# Altium project Switch.PrjPcb
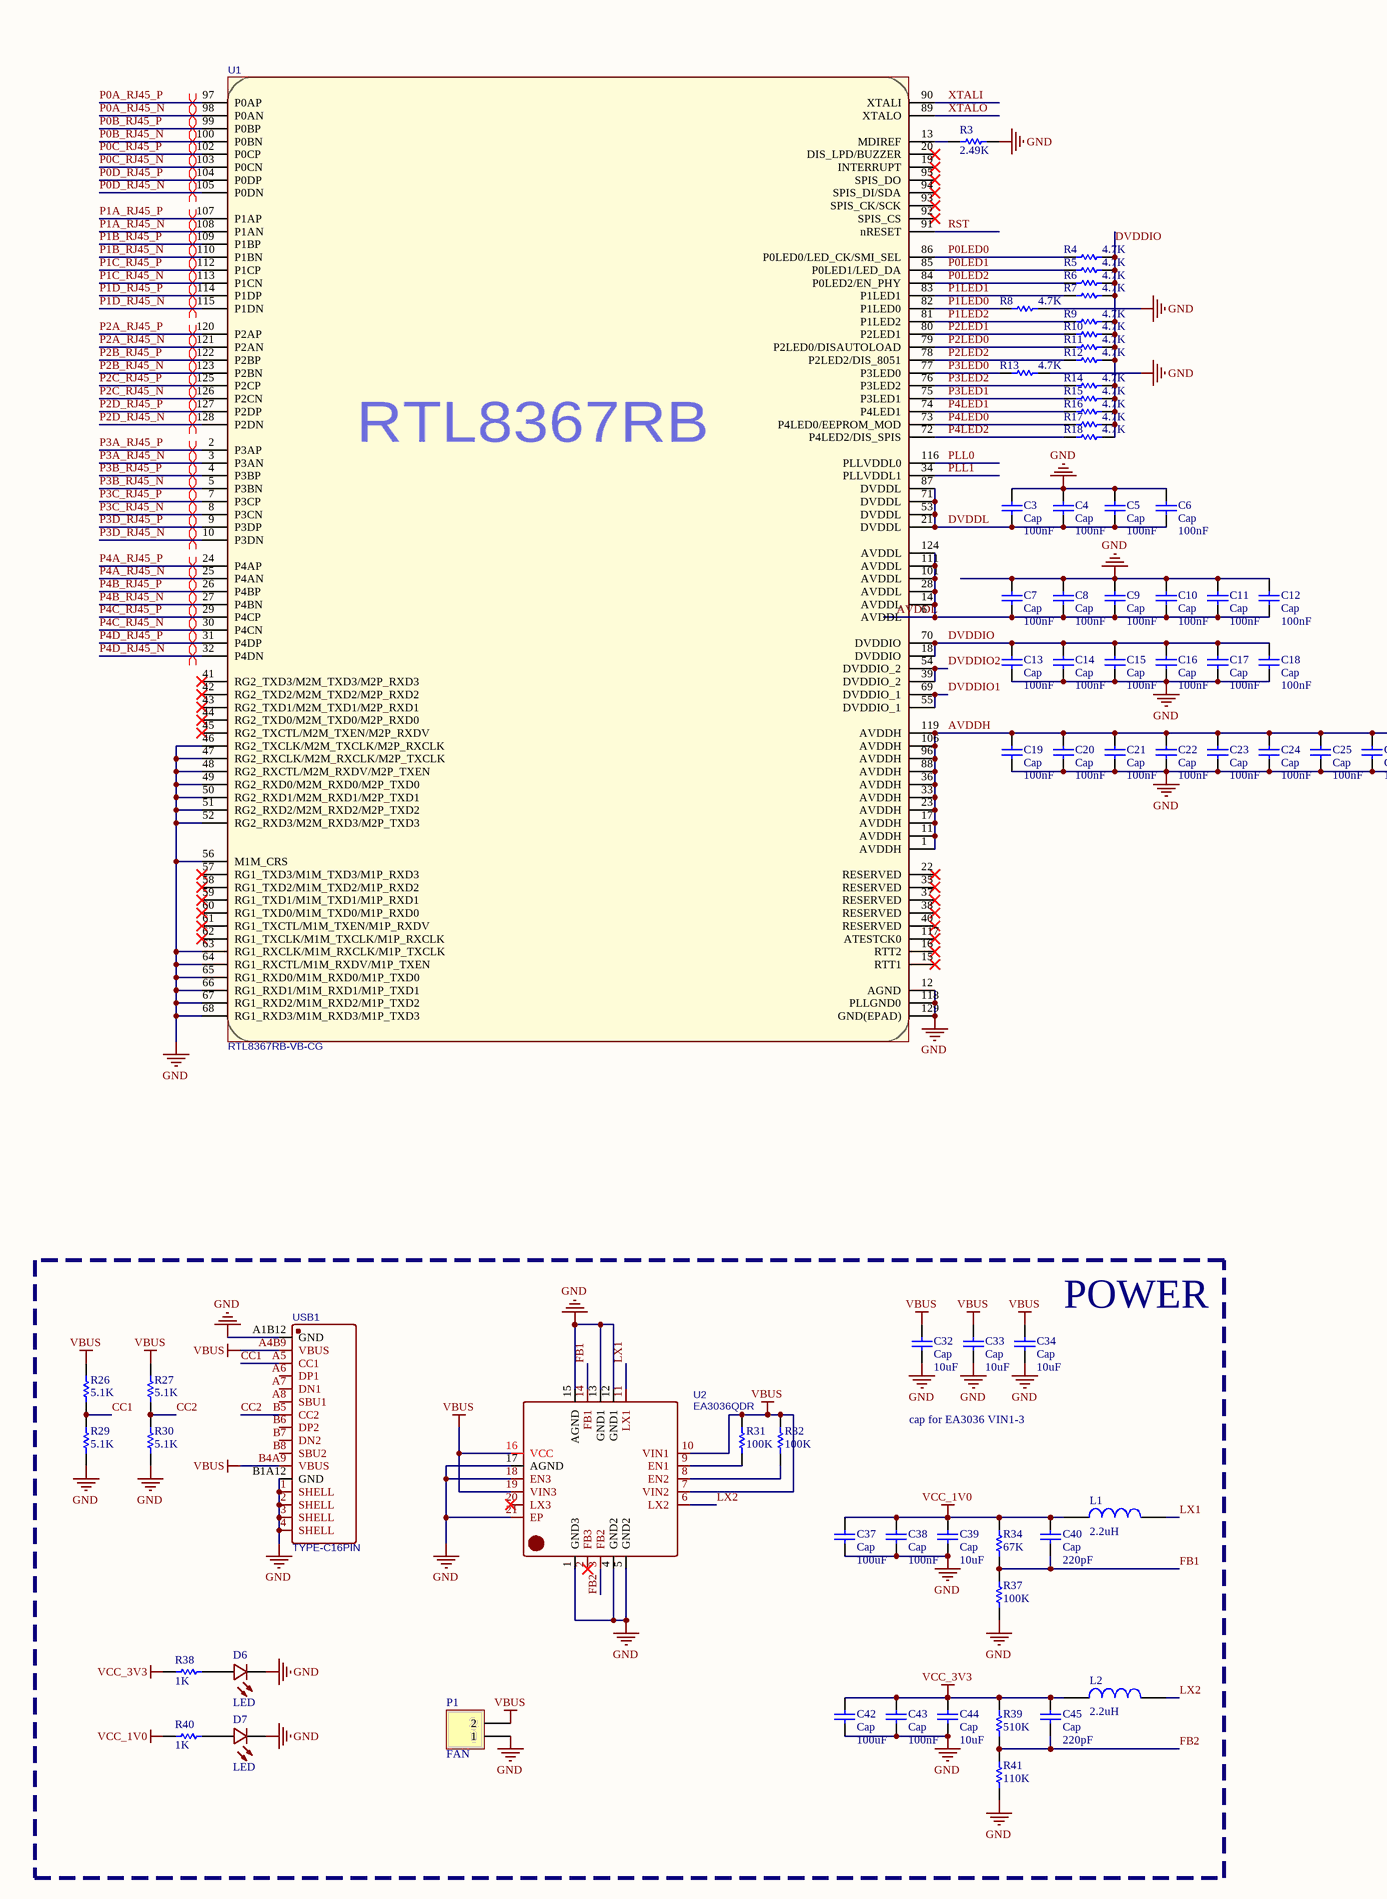
[diagram p0: switch.SchDoc, left]
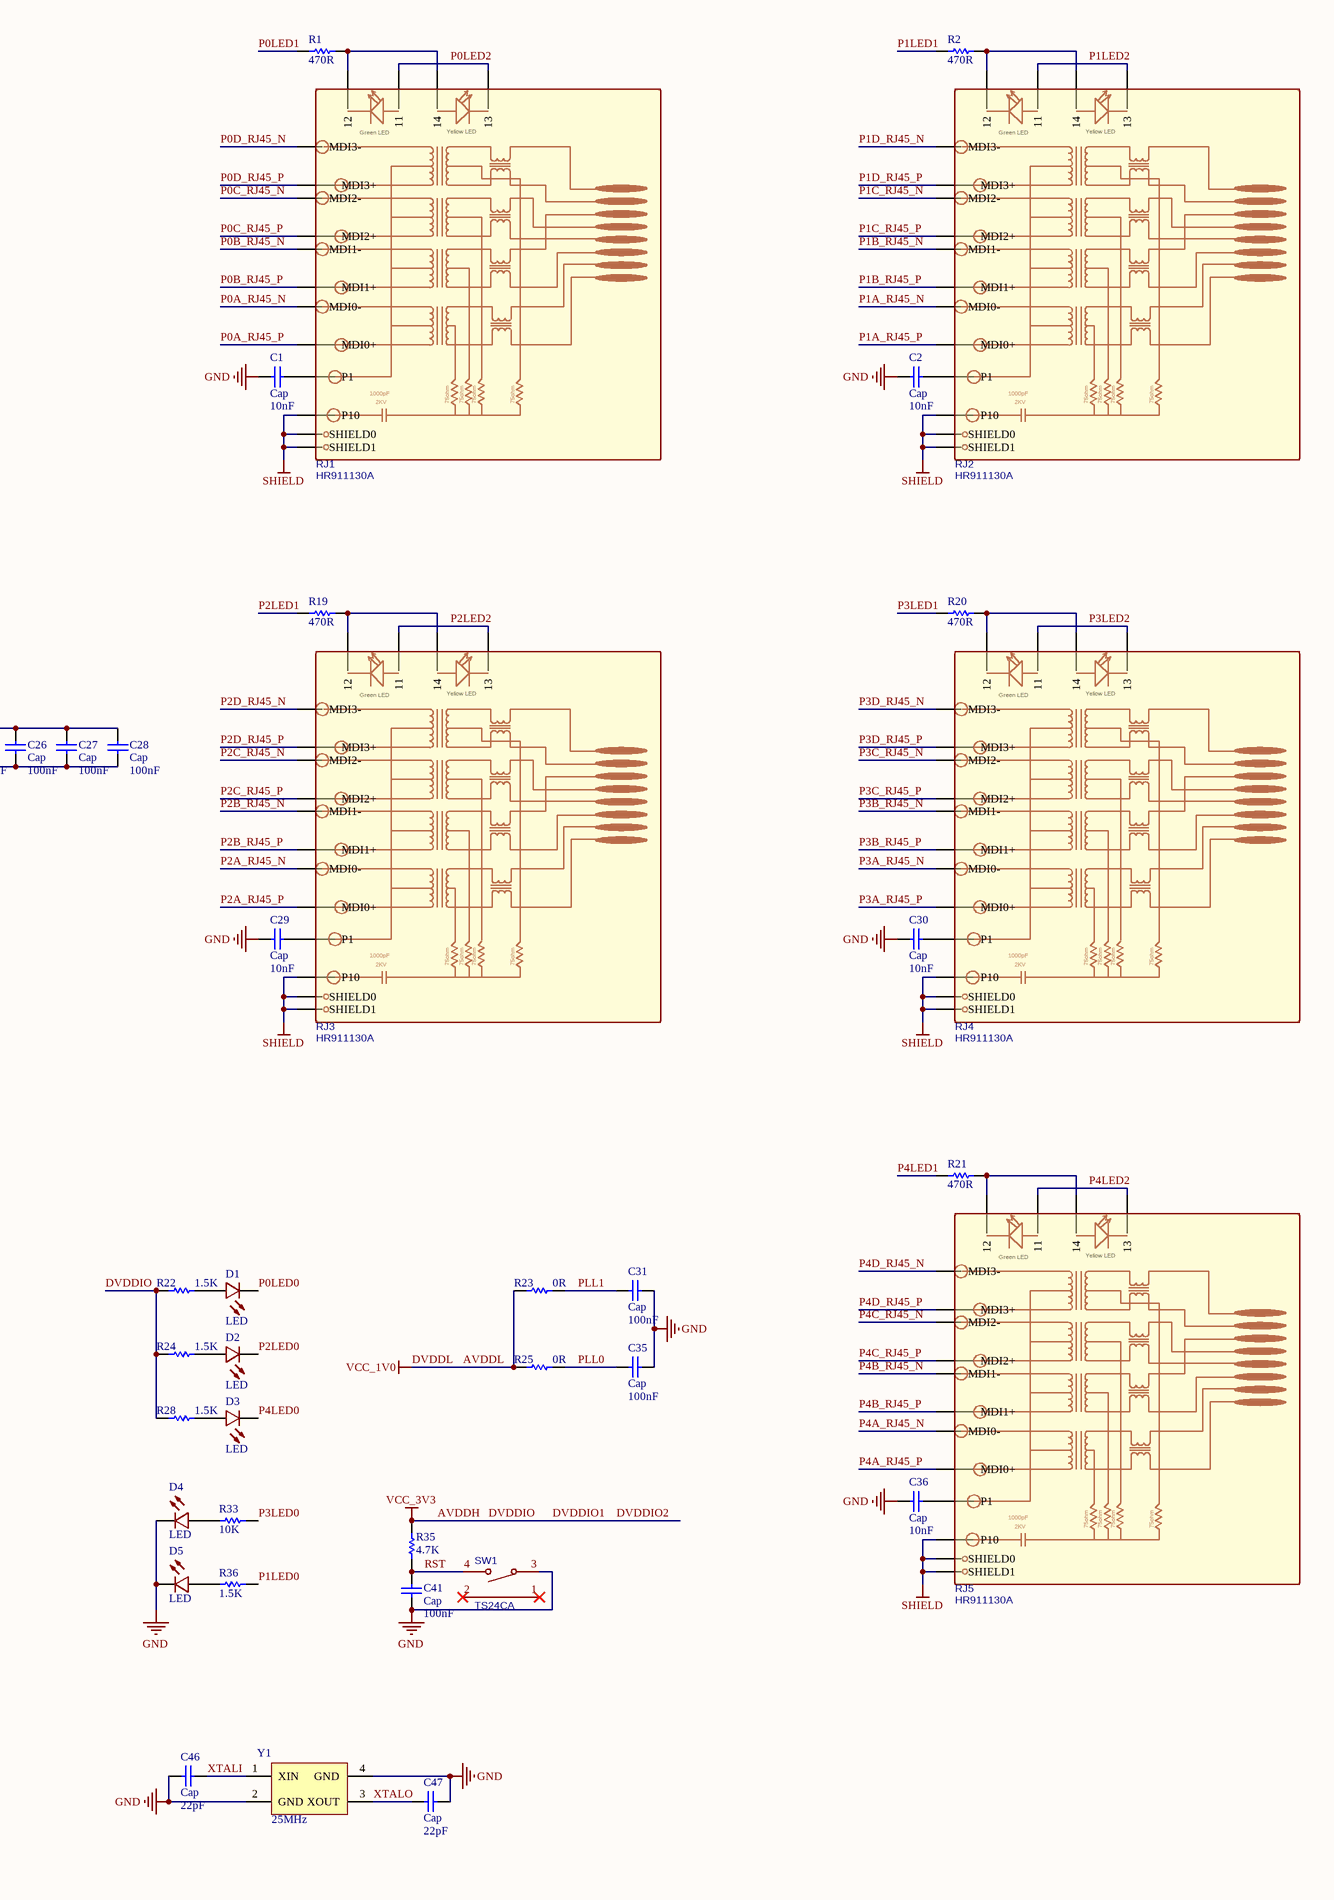
[diagram p1: switch.SchDoc, right]
1 sheet, 108 parts. Net scope: global (net labels, ports and power ports of the same name join across sheets).
Board file: switch.PcbDoc

## Sheet switch.SchDoc
size A2

### Parts
C1  Cap  value 10nF  [0603_C]
C2  Cap  value 10nF  [0603_C]
C3  Cap  value 100nF  [0603_C]
C4  Cap  value 100nF  [0603_C]
C5  Cap  value 100nF  [0603_C]
C6  Cap  value 100nF  [0603_C]
C7  Cap  value 100nF  [0603_C]
C8  Cap  value 100nF  [0603_C]
C9  Cap  value 100nF  [0603_C]
C10  Cap  value 100nF  [0603_C]
C11  Cap  value 100nF  [0603_C]
C12  Cap  value 100nF  [0603_C]
C13  Cap  value 100nF  [0603_C]
C14  Cap  value 100nF  [0603_C]
C15  Cap  value 100nF  [0603_C]
C16  Cap  value 100nF  [0603_C]
C17  Cap  value 100nF  [0603_C]
C18  Cap  value 100nF  [0603_C]
C19  Cap  value 100nF  [0603_C]
C20  Cap  value 100nF  [0603_C]
C21  Cap  value 100nF  [0603_C]
C22  Cap  value 100nF  [0603_C]
C23  Cap  value 100nF  [0603_C]
C24  Cap  value 100nF  [0603_C]
C25  Cap  value 100nF  [0603_C]
C26  Cap  value 100nF  [0603_C]
C27  Cap  value 100nF  [0603_C]
C28  Cap  value 100nF  [0603_C]
C29  Cap  value 10nF  [0603_C]
C30  Cap  value 10nF  [0603_C]
C31  Cap  value 100nF  [0603_C]
C32  Cap  value 10uF  [0603_C]
C33  Cap  value 10uF  [0603_C]
C34  Cap  value 10uF  [0603_C]
C35  Cap  value 100nF  [0603_C]
C36  Cap  value 10nF  [0603_C]
C37  Cap  value 100uF  [1206-CAP]
C38  Cap  value 100nF  [0603_C]
C39  Cap  value 10uF  [0603_C]
C40  Cap  value 220pF  [0603_C]
C41  Cap  value 100nF  [0603_C]
C42  Cap  value 100uF  [1206-CAP]
C43  Cap  value 100nF  [0603_C]
C44  Cap  value 10uF  [0603_C]
C45  Cap  value 220pF  [0603_C]
C46  Cap  value 22pF  [0603_C]
C47  Cap  value 22pF  [0603_C]
D1  LED  [LED0603-R-RD]
D2  LED  [LED0603-R-RD]
D3  LED  [LED0603-R-RD]
D4  LED  [LED0603-R-RD]
D5  LED  [LED0603-R-RD]
D6  LED  [LED0603-R-RD]
D7  LED  [LED0603-R-RD]
L1  2.2uH  [Inductor_1210]
L2  2.2uH  [Inductor_1210]
P1  FAN  [HDR1X2]
R1  470R  [0603-R]
R2  470R  [0603-R]
R3  2.49K  [0603-R]
R4  4.7K  [0603-R]
R5  4.7K  [0603-R]
R6  4.7K  [0603-R]
R7  4.7K  [0603-R]
R8  4.7K  [0603-R]
R9  4.7K  [0603-R]
R10  4.7K  [0603-R]
R11  4.7K  [0603-R]
R12  4.7K  [0603-R]
R13  4.7K  [0603-R]
R14  4.7K  [0603-R]
R15  4.7K  [0603-R]
R16  4.7K  [0603-R]
R17  4.7K  [0603-R]
R18  4.7K  [0603-R]
R19  470R  [0603-R]
R20  470R  [0603-R]
R21  470R  [0603-R]
R22  1.5K  [0603-R]
R23  0R  [0603-R]
R24  1.5K  [0603-R]
R25  0R  [0603-R]
R26  5.1K  [0603-R]
R27  5.1K  [0603-R]
R28  1.5K  [0603-R]
R29  5.1K  [0603-R]
R30  5.1K  [0603-R]
R31  100K  [0603-R]
R32  100K  [0603-R]
R33  10K  [0603-R]
R34  67K  [0603-R]
R35  4.7K  [0603-R]
R36  1.5K  [0603-R]
R37  100K  [0603-R]
R38  1K  [0603-R]
R39  510K  [0603-R]
R40  1K  [0603-R]
R41  110K  [0603-R]
RJ1  HR911130A  [RJ45-TH_HR911130A]
RJ2  HR911130A  [RJ45-TH_HR911130A]
RJ3  HR911130A  [RJ45-TH_HR911130A]
RJ4  HR911130A  [RJ45-TH_HR911130A]
RJ5  HR911130A  [RJ45-TH_HR911130A]
SW1  TS24CA  [SW-SMD_TS24CA]
U1  RTL8367RB-VB-CG  [LQFP-128]
U2  EA3036QDR  [QFN-20_L3.0-W3.0-P0.50-BL-EP1.7]
USB1  TYPE-C16PIN  [USB-C-SMD_TYPE-C16PIN]
Y1  25MHz  [晶振2520]

### Blocks framed on the sheet
POWER: C32-C34 C37-C40 C42-C45 D6 D7 L1 L2 P1 R26 R27 R29-R32 R34 R37-R41 U2 USB1

### Nets
AVDDH: C13.2 C14.2 C15.2 C16.2 C17.2 C18.2 C19.2 C20.2 C21.2 C22.2 C23.2 C24.2 C25.2 C26.2 C27.2 C28.2 C42.2 C43.2 C44.2 C45.2 L2.1 R4.2 R5.2 R6.2 R7.2 R9.2 R10.2 R11.2 R12.2 R14.2 R15.2 R16.2 R17.2 R18.2 R22.1 R24.1 R28.1 R35.1 R38.1 R39.2 U1.1(AVDDH) U1.11(AVDDH) U1.17(AVDDH) U1.18(DVDDIO) U1.23(AVDDH) U1.33(AVDDH) U1.36(AVDDH) U1.39(DVDDIO_2) U1.54(DVDDIO_2) U1.55(DVDDIO_1) U1.69(DVDDIO_1) U1.70(DVDDIO) U1.88(AVDDH) U1.96(AVDDH) U1.106(AVDDH) U1.119(AVDDH)  [also labelled DVDDIO, DVDDIO1, DVDDIO2, VCC_3V3]
AVDDL: C3.1 C4.1 C5.1 C6.1 C7.1 C8.1 C9.1 C10.1 C11.1 C12.1 C37.2 C38.2 C39.2 C40.2 L1.1 R23.1 R25.1 R34.2 R40.1 U1.6(AVDDL) U1.14(AVDDL) U1.21(DVDDL) U1.28(AVDDL) U1.53(DVDDL) U1.71(DVDDL) U1.87(DVDDL) U1.101(AVDDL) U1.111(AVDDL) U1.124(AVDDL)  [also labelled DVDDL, VCC_1V0]
GND: C1.2 C2.2 C3.2 C4.2 C5.2 C6.2 C7.2 C8.2 C9.2 C10.2 C11.2 C12.2 C13.1 C14.1 C15.1 C16.1 C17.1 C18.1 C19.1 C20.1 C21.1 C22.1 C23.1 C24.1 C25.1 C26.1 C27.1 C28.1 C29.2 C30.2 C31.1 C32.1 C33.1 C34.1 C35.1 C36.2 C37.1 C38.1 C39.1 C41.1 C42.1 C43.1 C44.1 C46.1 C47.2 D4.2(C) D5.2(C) D6.2(C) D7.2(C) P1.1 R3.2 R8.2 R13.2 R29.1 R30.1 R37.1 R41.1 SW1.3 U1.12(AGND) U1.46(RG2_TXCLK/M2M_TXCLK/M2P_RXCLK) U1.47(RG2_RXCLK/M2M_RXCLK/M2P_TXCLK) U1.48(RG2_RXCTL/M2M_RXDV/M2P_TXEN) U1.49(RG2_RXD0/M2M_RXD0/M2P_TXD0) U1.50(RG2_RXD1/M2M_RXD1/M2P_TXD1) U1.51(RG2_RXD2/M2M_RXD2/M2P_TXD2) U1.52(RG2_RXD3/M2M_RXD3/M2P_TXD3) U1.56(M1M_CRS) U1.63(RG1_RXCLK/M1M_RXCLK/M1P_TXCLK) U1.64(RG1_RXCTL/M1M_RXDV/M1P_TXEN) U1.65(RG1_RXD0/M1M_RXD0/M1P_TXD0) U1.66(RG1_RXD1/M1M_RXD1/M1P_TXD1) U1.67(RG1_RXD2/M1M_RXD2/M1P_TXD2) U1.68(RG1_RXD3/M1M_RXD3/M1P_TXD3) U1.118(PLLGND0) U1.129(GND(EPAD)) U2.1(GND3) U2.4(GND2) U2.5(GND2) U2.12(GND1) U2.13(GND1) U2.15(AGND) U2.17(AGND) U2.18(EN3) U2.21(EP) USB1.1(SHELL) USB1.2(SHELL) USB1.3(SHELL) USB1.4(SHELL) USB1.A1B12(GND) USB1.B1A12(GND) Y1.2(GND) Y1.4(GND)
SHIELD: RJ1.P10 RJ1.SHIELD0 RJ1.SHIELD1 RJ2.P10 RJ2.SHIELD0 RJ2.SHIELD1 RJ3.P10 RJ3.SHIELD0 RJ3.SHIELD1 RJ4.P10 RJ4.SHIELD0 RJ4.SHIELD1 RJ5.P10 RJ5.SHIELD0 RJ5.SHIELD1
VBUS: C32.2 C33.2 C34.2 P1.2 R26.2 R27.2 R31.1 R32.1 U2.7(VIN2) U2.10(VIN1) U2.16(VCC) U2.19(VIN3) USB1.A4B9(VBUS) USB1.B4A9(VBUS)
CC1: R26.1 R29.2 USB1.A5(CC1)
CC2: R27.1 R30.2 USB1.B5(CC2)
FB1: C40.1 R34.1 R37.2 U2.14(FB1)
FB2: C45.1 R39.1 R41.2 U2.3(FB2)
LX1: L1.2 U2.11(LX1)
LX2: L2.2 U2.6(LX2)
P0A_RJ45_N: RJ1.P3(MDI0-) U1.98(P0AN)
P0A_RJ45_P: RJ1.P2(MDI0+) U1.97(P0AP)
P0B_RJ45_N: RJ1.P7(MDI1-) U1.100(P0BN)
P0B_RJ45_P: RJ1.P4(MDI1+) U1.99(P0BP)
P0C_RJ45_N: RJ1.P6(MDI2-) U1.103(P0CN)
P0C_RJ45_P: RJ1.P5(MDI2+) U1.102(P0CP)
P0D_RJ45_N: RJ1.P9(MDI3-) U1.105(P0DN)
P0D_RJ45_P: RJ1.P8(MDI3+) U1.104(P0DP)
P0LED0: D1.2(C) R4.1 U1.86(P0LED0/LED_CK/SMI_SEL)
P0LED1: R1.1 R5.1 U1.85(P0LED1/LED_DA)
P0LED2: R6.1 RJ1.11 RJ1.13 U1.84(P0LED2/EN_PHY)
P1A_RJ45_N: RJ2.P3(MDI0-) U1.108(P1AN)
P1A_RJ45_P: RJ2.P2(MDI0+) U1.107(P1AP)
P1B_RJ45_N: RJ2.P7(MDI1-) U1.110(P1BN)
P1B_RJ45_P: RJ2.P4(MDI1+) U1.109(P1BP)
P1C_RJ45_N: RJ2.P6(MDI2-) U1.113(P1CN)
P1C_RJ45_P: RJ2.P5(MDI2+) U1.112(P1CP)
P1D_RJ45_N: RJ2.P9(MDI3-) U1.115(P1DN)
P1D_RJ45_P: RJ2.P8(MDI3+) U1.114(P1DP)
P1LED0: R8.1 R36.1 U1.82(P1LED0)
P1LED1: R2.1 R7.1 U1.83(P1LED1)
P1LED2: R9.1 RJ2.11 RJ2.13 U1.81(P1LED2)
P2A_RJ45_N: RJ3.P3(MDI0-) U1.121(P2AN)
P2A_RJ45_P: RJ3.P2(MDI0+) U1.120(P2AP)
P2B_RJ45_N: RJ3.P7(MDI1-) U1.123(P2BN)
P2B_RJ45_P: RJ3.P4(MDI1+) U1.122(P2BP)
P2C_RJ45_N: RJ3.P6(MDI2-) U1.126(P2CN)
P2C_RJ45_P: RJ3.P5(MDI2+) U1.125(P2CP)
P2D_RJ45_N: RJ3.P9(MDI3-) U1.128(P2DN)
P2D_RJ45_P: RJ3.P8(MDI3+) U1.127(P2DP)
P2LED0: D2.2(C) R11.1 U1.79(P2LED0/DISAUTOLOAD)
P2LED1: R10.1 R19.1 U1.80(P2LED1)
P2LED2: R12.1 RJ3.11 RJ3.13 U1.78(P2LED2/DIS_8051)
P3A_RJ45_N: RJ4.P3(MDI0-) U1.3(P3AN)
P3A_RJ45_P: RJ4.P2(MDI0+) U1.2(P3AP)
P3B_RJ45_N: RJ4.P7(MDI1-) U1.5(P3BN)
P3B_RJ45_P: RJ4.P4(MDI1+) U1.4(P3BP)
P3C_RJ45_N: RJ4.P6(MDI2-) U1.8(P3CN)
P3C_RJ45_P: RJ4.P5(MDI2+) U1.7(P3CP)
P3D_RJ45_N: RJ4.P9(MDI3-) U1.10(P3DN)
P3D_RJ45_P: RJ4.P8(MDI3+) U1.9(P3DP)
P3LED0: R13.1 R33.1 U1.77(P3LED0)
P3LED1: R15.1 R20.1 U1.75(P3LED1)
P3LED2: R14.1 RJ4.11 RJ4.13 U1.76(P3LED2)
P4A_RJ45_N: RJ5.P3(MDI0-) U1.25(P4AN)
P4A_RJ45_P: RJ5.P2(MDI0+) U1.24(P4AP)
P4B_RJ45_N: RJ5.P7(MDI1-) U1.27(P4BN)
P4B_RJ45_P: RJ5.P4(MDI1+) U1.26(P4BP)
P4C_RJ45_N: RJ5.P6(MDI2-) U1.30(P4CN)
P4C_RJ45_P: RJ5.P5(MDI2+) U1.29(P4CP)
P4D_RJ45_N: RJ5.P9(MDI3-) U1.32(P4DN)
P4D_RJ45_P: RJ5.P8(MDI3+) U1.31(P4DP)
P4LED0: D3.2(C) R17.1 U1.73(P4LED0/EEPROM_MOD)
P4LED1: R16.1 R21.1 U1.74(P4LED1)
P4LED2: R18.1 RJ5.11 RJ5.13 U1.72(P4LED2/DIS_SPIS)
PLL0: C35.2 R25.2 U1.116(PLLVDDL0)
PLL1: C31.2 R23.2 U1.34(PLLVDDL1)
RST: C41.2 R35.2 SW1.4 U1.91(nRESET)
XTALI: C46.2 U1.90(XTALI) Y1.1(XIN)
XTALO: C47.1 U1.89(XTALO) Y1.3(XOUT)
NetC1_1: C1.1 RJ1.P1
NetC2_1: C2.1 RJ2.P1
NetC29_1: C29.1 RJ3.P1
NetC30_1: C30.1 RJ4.P1
NetC36_1: C36.1 RJ5.P1
NetD1_1: D1.1(A) R22.2
NetD2_1: D2.1(A) R24.2
NetD3_1: D3.1(A) R28.2
NetD4_1: D4.1(A) R33.2
NetD5_1: D5.1(A) R36.2
NetD6_1: D6.1(A) R38.2
NetD7_1: D7.1(A) R40.2
NetR1_2: R1.2 RJ1.12 RJ1.14
NetR2_2: R2.2 RJ2.12 RJ2.14
NetR3_1: R3.1 U1.13(MDIREF)
NetR19_2: R19.2 RJ3.12 RJ3.14
NetR20_2: R20.2 RJ4.12 RJ4.14
NetR21_2: R21.2 RJ5.12 RJ5.14
NetR31_2: R31.2 U2.9(EN1)
NetR32_2: R32.2 U2.8(EN2)

Not connected (* = marked no-connect by the designer): SW1 1* 2*; U1 15(RTT1)* 16(RTT2)* 19(INTERRUPT)* 20(DIS_LPD/BUZZER)* 22(RESERVED)* 35(RESERVED)* 37(RESERVED)* 38(RESERVED)* 40(RESERVED)* 41(RG2_TXD3/M2M_TXD3/M2P_RXD3)* 42(RG2_TXD2/M2M_TXD2/M2P_RXD2)* 43(RG2_TXD1/M2M_TXD1/M2P_RXD1)* 44(RG2_TXD0/M2M_TXD0/M2P_RXD0)* 45(RG2_TXCTL/M2M_TXEN/M2P_RXDV)* 57(RG1_TXD3/M1M_TXD3/M1P_RXD3)* 58(RG1_TXD2/M1M_TXD2/M1P_RXD2)* 59(RG1_TXD1/M1M_TXD1/M1P_RXD1)* 60(RG1_TXD0/M1M_TXD0/M1P_RXD0)* 61(RG1_TXCTL/M1M_TXEN/M1P_RXDV)* 62(RG1_TXCLK/M1M_TXCLK/M1P_RXCLK)* 92(SPIS_CS)* 93(SPIS_CK/SCK)* 94(SPIS_DI/SDA)* 95(SPIS_DO)* 117(ATESTCK0)*; U2 2(FB3)* 20(LX3)*; USB1 A6(DP1) A7(DN1) A8(SBU1) B6(DP2) B7(DN2) B8(SBU2)

### Layout directives
differential pair: P0A_RJ45_N, P0A_RJ45_P, P0B_RJ45_N, P0B_RJ45_P, P0C_RJ45_N, P0C_RJ45_P, P0D_RJ45_N, P0D_RJ45_P, P1A_RJ45_N, P1A_RJ45_P, P1B_RJ45_N, P1B_RJ45_P, P1C_RJ45_N, P1C_RJ45_P, P1D_RJ45_N, P1D_RJ45_P, P2A_RJ45_N, P2A_RJ45_P, P2B_RJ45_N, P2B_RJ45_P, P2C_RJ45_N, P2C_RJ45_P, P2D_RJ45_N, P2D_RJ45_P, P3A_RJ45_N, P3A_RJ45_P, P3B_RJ45_N, P3B_RJ45_P, P3C_RJ45_N, P3C_RJ45_P, P3D_RJ45_N, P3D_RJ45_P, P4A_RJ45_N, P4A_RJ45_P, P4B_RJ45_N, P4B_RJ45_P, P4C_RJ45_N, P4C_RJ45_P, P4D_RJ45_N, P4D_RJ45_P

### Notes on the sheet
- cap for EA3036 VIN1-3
- (in symbol HR911130A) Yellow LED; Green LED; J8; J7; J6 RX-; J5; J4; J3 RX+; J2 TX-; J1 TX+; 1000pF; 75ohm; 2KV
- (in symbol RTL8367RB-VB-CG) RTL8367RB

### Library data of the parts
C1-C47 = Cap: Capacitor; Published: 8-Jun-2000; LatestRevisionDate: 17-Jul-2002; LatestRevisionNote: Re-released for DXP Platform.; PackageReference: RAD-0.3; Publisher: Altium Limited; PackageDescription: Radial Cap, Thru-Hole; 2 Leads; 0.3 in Pin Spacing
D1-D7 = LED: 发光二极管
L1 L2 = INDUCTOR
P1 = Header 2: Header, 2-Pin; LatestRevisionDate: 17-Jul-2002; LatestRevisionNote: Re-released for DXP Platform.; Publisher: Altium Limited
R1-R41 = RES
RJ1-RJ5 = HR911130A: BOM_Manufacturer: HANRUN; BOM_Supplier: LCSC; BOM_Manufacturer Part: HR911130A; BOM_Supplier Part: C54408; spicePre: R; spiceSymbolName: HR911130A
SW1 = KEY2: BOM_Manufacturer: SHOU HAN; Contributor: LCSC; BOM_Supplier: LCSC; BOM_Supplier Part: C393942; BOM_Manufacturer Part: TS24CA; spicePre: S; spiceSymbolName: TS24CA
U1 = RTL8367RB-VB-CG: Contributor: libc0607; link: https://www.realtek.com/en/products/communications-network-ics/item/rtl8367rb-vb-cg; spicePre: U; spiceSymbolName: RTL8367RB-VB-CG
U2 = EA3036QDR: BOM_Manufacturer: Everanalog; SMT Type: Extend; spicePre: X; BOM_Manufacturer Part: EA3036QDR; BOM_Supplier: LCSC; BOM_Supplier Part: C111587; BOM_LCSC Assembly: Yes; spiceSymbolName: EA3036QDR
USB1 = TYPE-C16PIN: BOM_Manufacturer: SHOU HAN; Contributor: LCSC; BOM_Supplier: LCSC; BOM_Supplier Part: C393939; BOM_Manufacturer Part: TYPE-C16PIN; spicePre: U; spiceSymbolName: TYPE-C16PIN
Y1 = 晶振-4Pin-无源: 2520无源; MF: ECS International; MP: ECS-3225S30-240-EN-TR; Package: SMD-6 ECS International; Price: 0.75 USD; Availability: Unavailable; Value: *